# Altium schematic sheet [05] - EEPROM-RTC-LCD.SchDoc
size A3; DocumentNumber: 5; SheetNumber: 5; SheetTotal: 9
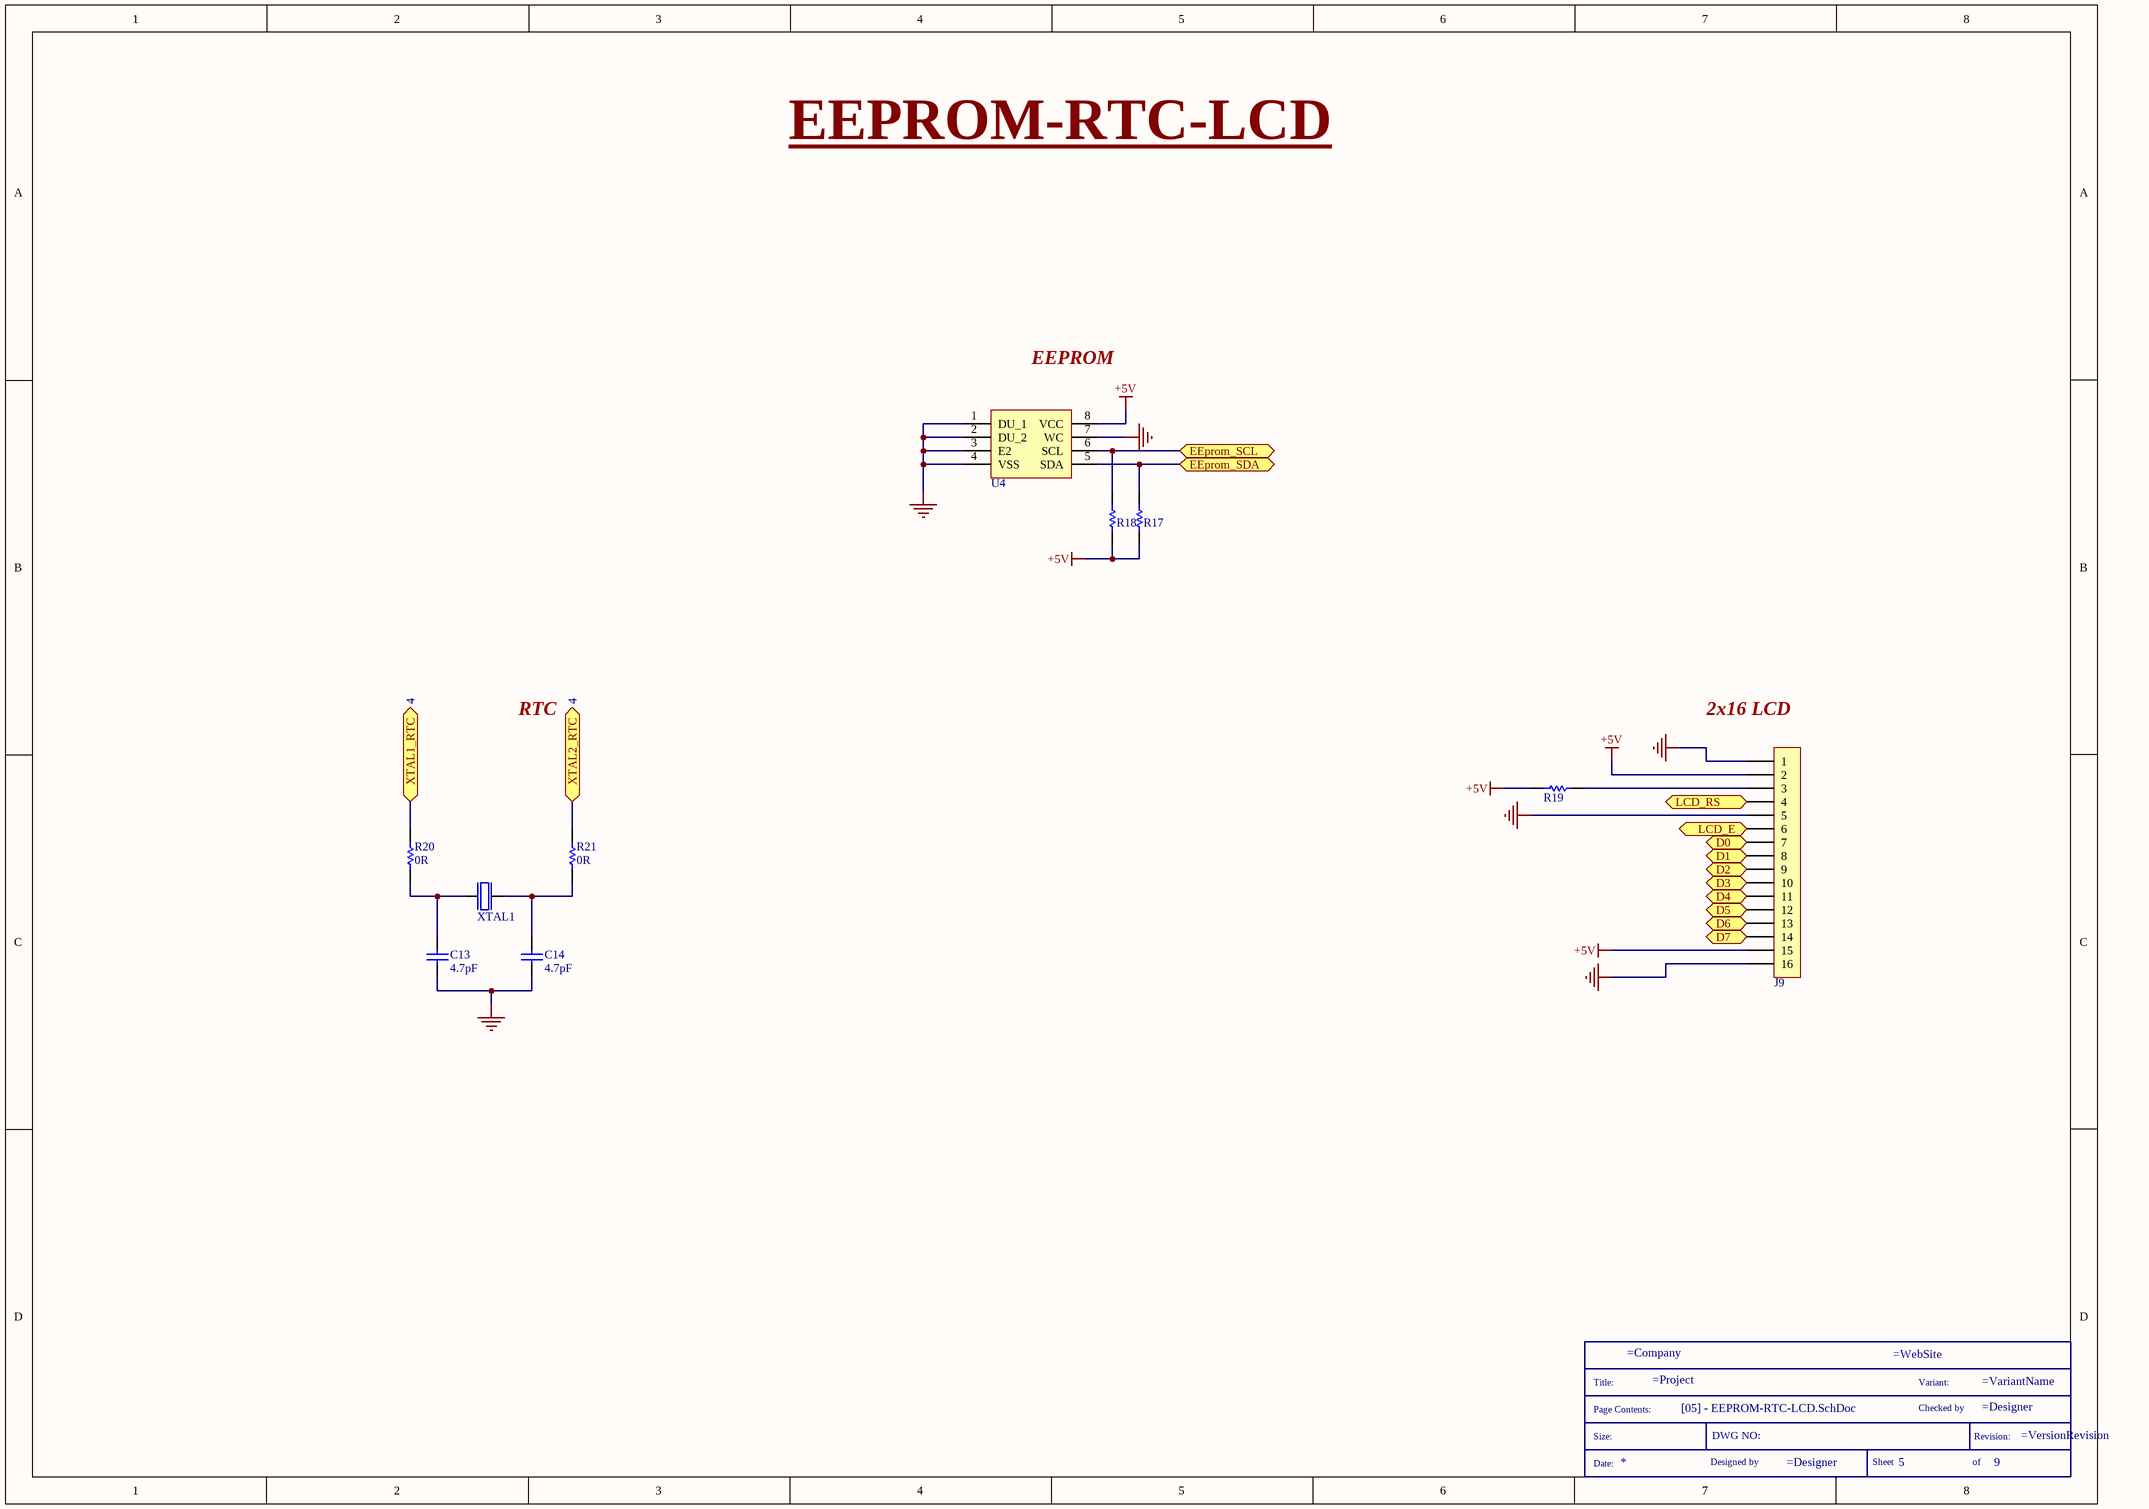
[diagram p0: [05] - EEPROM-RTC-LCD.SchDoc]

## Parts
*  SCH_TITLE  (value not drawn)  (graphical)
C13  4.7pF  [C0603]
C14  4.7pF  [C0603]
J9  HDR FEMALE 1x16 2.54MM  [HDR_FEMALE_1x16_2.54MM]  (value not drawn)
R17  5.6k 1/8W  [RES_0805]  (value not drawn)
R18  5.6k 1/8W  [RES_0805]  (value not drawn)
R19  1K 1/8W  [RES_0805]  (value not drawn)
R20  0R  [R0805]
R21  0R  [R0805]
U4  2M EEPROM  [SOIC-8]  (value not drawn)
XTAL1  32.768KHZ  [XTAL_2SMD]  (value not drawn)

## Ports
D0, D1, D2, D3, D4, D5, D6, D7, EEprom_SCL, EEprom_SDA, LCD_E, LCD_RS, XTAL1_RTC (see 4), XTAL2_RTC (see 4)

## Nets
+5V: J9.2 J9.15 R17.1 R18.1 R19.1 U4.8(VCC)
GND: C13.1 C14.1 J9.1 J9.5 J9.16 U4.1(DU_1) U4.2(DU_2) U4.3(E2) U4.4(VSS) U4.7(WC)
D0: J9.7 ; port D0
D1: J9.8 ; port D1
D2: J9.9 ; port D2
D3: J9.10 ; port D3
D4: J9.11 ; port D4
D5: J9.12 ; port D5
D6: J9.13 ; port D6
D7: J9.14 ; port D7
EEprom_SCL: R18.2 U4.6(SCL) ; port EEprom_SCL
EEprom_SDA: R17.2 U4.5(SDA) ; port EEprom_SDA
LCD_E: J9.6 ; port LCD_E
LCD_RS: J9.4 ; port LCD_RS
XTAL1_RTC: R20.2 ; port XTAL1_RTC
XTAL2_RTC: R21.2 ; port XTAL2_RTC
NetC13_2: C13.2 R20.1 XTAL1.1
NetC14_2: C14.2 R21.1 XTAL1.2
NetJ9_3: J9.3 R19.2

## Notes on the sheet
- EEPROM-RTC-LCD
- EEPROM
- RTC
- 2x16 LCD
- (in symbol SCH_TITLE) Title:; Variant:; Page Contents:; Checked by; Size:; DWG NO:; Revision:; Date:; Designed by; Sheet; of

## Library data of the parts
* = SCH_TITLE: Schematic information
C13 C14 = CGA3E2C0G1H4R7C080AA: CAP CER 4.7PF 50V C0G 0603; Manufacturer 1: TDK Corporation; Category: Ceramic Capacitors; Manufacturer Part Number 1: CGA3E2C0G1H4R7C080AA; Case/Package: 0603 (1608 Metric); Quantity: 2; Supplier 1: Digikey; Supplier Part Number 1: 445-5621-1-ND; Supplier Order Qty 1: 1; Supplier Stock 1: 2040; Supplier Unit Price 1: 0,21; Supplier Currency 1: $
J9 = PPTC161LFBN-RC: Manufacturer 1: Sullins Connector Solutions; Category: Rectangular Connectors - Headers, Receptacles, Female Sockets; Manufacturer Part Number 1: PPTC161LFBN-RC; Case/Package: 16Pos_2.5mm_Pitch; Quantity: 1; Supplier 1: Digikey; Supplier Part Number 1: S7014-ND; Supplier Order Qty 1: 1; Supplier Stock 1: 9562; Supplier Unit Price  1: 0,98; Supplier Currency 1: $
R17 R18 = ERJ-6ENF5601V: RES SMD 5.6K OHM 1% 1/8W 0805; Manufacturer 1: Panasonic Electronic Components; Category: Chip Resistor - Surface Mount; Manufacturer Part Number 1: ERJ-6ENF5601V; Case/Package: 0805 (2012 Metric); Quantity: 1; Supplier 1: Digikey; Supplier Part Number 1: P5.60KCCT-ND; Supplier Order Qty 1: 1; Supplier Stock 1: 71341; Supplier Unit Price 1: 0,1; Supplier Currency 1: $
R19 = ERJ-6ENF1001V: RES SMD 1K OHM; Manufacturer 1: Panasonic Electronic Components; Category: Chip Resistor - Surface Mount; Manufacturer Part Number 1: ERJ-6ENF1001V; Case/Package: 0805 (2012 Metric); Quantity: 1; Supplier 1: Digikey; Supplier Part Number 1: P1.00KCCT-ND; Supplier Order Qty 1: 1; Supplier Stock 1: 1361018; Supplier Unit Price 1: 0,1; Supplier Currency 1: $
R20 R21 = CRCW08050000Z0EA: RES SMD 0 OHM JUMPER 1/8W 0805; Manufacturer 1: Vishay Dale; Category: Chip Resistor - Surface Mount; Manufacturer Part Number 1: CRCW08050000Z0EA; Case/Package: 0805 (2012 Metric); Quantity: 1; Supplier 1: Digikey; Supplier Part Number 1: 541-0.0ACT-ND; Supplier Order Qty 1: 1; Supplier Stock 1: 609778; Supplier Unit Price 1: 0,10; Supplier Currency 1: $
U4 = M24M02-DWMN3TP/K: IC EEPROM 2M I2C 1MHZ 8SO; Manufacturer 1: STMicroelectronics; Category: Memory; Manufacturer Part Number 1: M24M02-DWMN3TP/K; Case/Package: 8-SOIC (0.154", 3.90mm Width); Quantity: 1; Supplier 1: Digikey; Supplier Part Number 1: 497-16238-1-ND; Supplier Order Qty 1: 1; Supplier Stock 1: 6027; Supplier Unit Price 1: 3,28; Supplier Currency 1: $
XTAL1 = ECS-.327-6-34QCS-TR: CRYSTAL 32.768KHZ; Manufacturer 1: ECS Inc.; Category: Crystals; Manufacturer Part Number 1: ECS-.327-6-34QCS-TR; Case/Package: 2-SMD, No Lead; Quantity: 1; Supplier 1: Digikey; Supplier Part Number 1: XC2162CT-ND; Supplier Order Qty 1: 1; Supplier Stock 1: 1833; Supplier Unit Price 1: 0,83; Supplier Currency 1: $